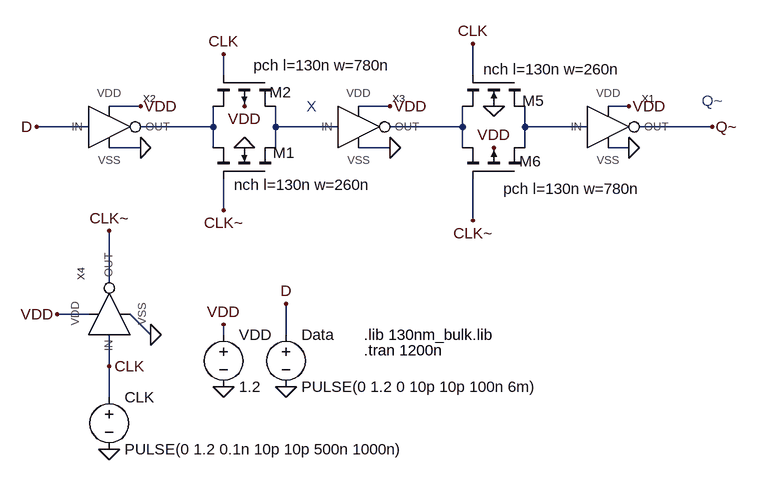
[diagram p0: schematic Prob2.asc]
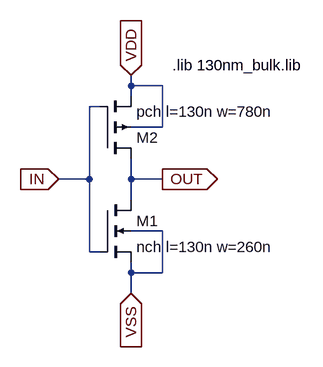
[diagram p1: sub-circuit inverter.asc]
Prob2.asc, the LTspice schematic file:
Version 4.1
SHEET 1 1764 1012
WIRE 224 208 224 176
WIRE 608 208 608 160
WIRE 96 256 48 256
WIRE 480 256 432 256
WIRE 848 256 816 256
WIRE 16 288 -64 288
WIRE 208 288 208 256
WIRE 208 288 96 288
WIRE 304 288 304 256
WIRE 400 288 304 288
WIRE 592 288 592 256
WIRE 592 288 480 288
WIRE 688 288 688 256
WIRE 784 288 688 288
WIRE 976 288 864 288
WIRE 96 320 48 320
WIRE 208 320 208 288
WIRE 304 320 304 288
WIRE 480 320 432 320
WIRE 592 320 592 288
WIRE 688 320 688 288
WIRE 848 320 816 320
WIRE 224 416 224 368
WIRE 608 432 608 368
WIRE 48 528 48 448
WIRE 16 576 -32 576
WIRE 112 608 80 576
WIRE 224 608 224 592
WIRE 320 608 320 560
WIRE 48 656 48 608
WIRE 48 704 48 656
FLAG 224 416 CLK~
FLAG 224 176 CLK
FLAG 608 432 CLK~
FLAG 608 160 CLK
FLAG 224 688 0
FLAG 224 592 VDD
FLAG 640 320 VDD
FLAG 256 256 VDD
FLAG 256 320 0
FLAG 640 256 0
FLAG 848 320 0
FLAG 480 320 0
FLAG 96 320 0
FLAG 848 256 VDD
FLAG 480 256 VDD
FLAG 96 256 VDD
FLAG 48 784 0
FLAG 48 656 CLK
FLAG 976 288 Q~
FLAG 320 688 0
FLAG 320 560 D
FLAG -64 288 D
FLAG 112 608 0
FLAG -32 576 VDD
FLAG 48 448 CLK~
SYMBOL INVERTER 816 288 R0
SYMATTR InstName X1
SYMBOL INVERTER 48 288 R0
SYMATTR InstName X2
SYMBOL INVERTER 432 288 R0
SYMATTR InstName X3
SYMBOL lib\\lib\\sym\\pmos4 304 208 R90
WINDOW 0 120 -30 VRight 2
WINDOW 3 -15 -178 VRight 2
SYMATTR InstName M1
SYMATTR Value pch l=130n w=780n
SYMBOL lib\\lib\\sym\\nmos4 304 368 M270
WINDOW 0 133 9 VLeft 2
WINDOW 3 -9 64 VLeft 2
SYMATTR InstName M2
SYMATTR Value nch l=130n w=260n
SYMBOL lib\\lib\\sym\\pmos4 688 368 M270
WINDOW 0 120 -30 VRight 2
WINDOW 3 -15 -178 VRight 2
SYMATTR InstName M5
SYMATTR Value pch l=130n w=780n
SYMBOL lib\\lib\\sym\\nmos4 688 208 R90
WINDOW 0 133 9 VLeft 2
WINDOW 3 -9 64 VLeft 2
SYMATTR InstName M6
SYMATTR Value nch l=130n w=260n
SYMBOL voltage 224 592 R0
WINDOW 123 0 0 Left 0
WINDOW 39 0 0 Left 0
SYMATTR InstName VDD
SYMATTR Value 1.2
SYMBOL voltage 48 688 R0
WINDOW 123 0 0 Left 0
WINDOW 39 0 0 Left 0
SYMATTR InstName CLK
SYMATTR Value PULSE(0 1.2 0.1n 10p 10p 500n 1000n)
SYMBOL voltage 320 592 R0
WINDOW 123 0 0 Left 0
WINDOW 39 0 0 Left 0
SYMATTR InstName Data
SYMATTR Value PULSE(0 1.2 0 10p 10p 100n 6m)
SYMBOL INVERTER 48 576 R270
SYMATTR InstName X4
TEXT 440 632 Left 2 !.tran 1200n
TEXT 440 608 Left 2 !.lib 130nm_bulk.lib
TEXT 352 256 Left 2 ;X
TEXT 960 248 Left 2 ;Q~

inverter.asc, the sub-circuit schematic file:
Version 4.1
SHEET 1 880 680
WIRE 256 -16 256 -32
WIRE 304 -16 256 -16
WIRE 256 0 256 -16
WIRE 208 16 192 16
WIRE 304 48 304 -16
WIRE 304 48 256 48
WIRE 192 128 192 16
WIRE 192 128 144 128
WIRE 256 128 256 96
WIRE 304 128 256 128
WIRE 256 160 256 128
WIRE 304 208 256 208
WIRE 192 240 192 128
WIRE 208 240 192 240
WIRE 256 272 256 256
WIRE 304 272 304 208
WIRE 304 272 256 272
WIRE 256 304 256 272
FLAG 144 128 IN
IOPIN 144 128 In
FLAG 256 -32 VDD
IOPIN 256 -32 In
FLAG 256 304 VSS
IOPIN 256 304 In
FLAG 304 128 OUT
IOPIN 304 128 Out
SYMBOL lib\\lib\\sym\\nmos4 208 160 R0
SYMATTR InstName M1
SYMATTR Value nch l=130n w=260n
SYMBOL lib\\lib\\sym\\pmos4 208 96 M180
SYMATTR InstName M2
SYMATTR Value pch l=130n w=780n
TEXT 320 -48 Left 2 !.lib 130nm_bulk.lib

The netlist it stands for:
* Prob2.asc
X§X1 N004 Q~ VDD 0 inverter
X§X2 D N001 VDD 0 inverter
X§X3 N002 N003 VDD 0 inverter
M1 N002 CLK N001 VDD pch l=130n w=780n
M2 N002 CLK~ N001 0 nch l=130n w=260n
M5 N004 CLK~ N003 VDD pch l=130n w=780n
M6 N004 CLK N003 0 nch l=130n w=260n
VDD VDD 0 1.2
V§CLK CLK 0 PULSE(0 1.2 0.1n 10p 10p 500n 1000n)
V§Data D 0 PULSE(0 1.2 0 10p 10p 100n 6m)
X§X4 CLK CLK~ VDD 0 inverter

* block symbol definitions
.subckt inverter IN OUT VDD VSS
M1 OUT IN VSS VSS nch l=130n w=260n
M2 OUT IN VDD VDD pch l=130n w=780n
.lib 130nm_bulk.lib
.ends inverter

.model NMOS NMOS
.model PMOS PMOS
.lib standard.mos
.tran 1200n
.lib 130nm_bulk.lib
* X
* Q~
.backanno
.end